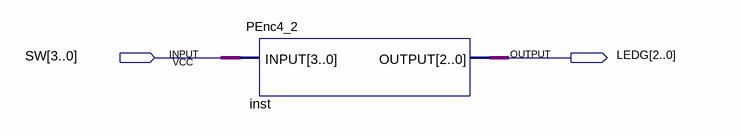
[diagram p0: schematic sheet]
// Quartus schematic PEnc4_2.bdf as structural Verilog: 1 symbols, 2 pins
module PEnc4_2 (
  input  [3:0] SW,
  output [2:0] LEDG
);

  PEnc4_2 inst (.INPUT(SW), .OUTPUT(LEDG));
endmodule
